# EAGLE schematic toyotune_3s_coolrunner (EAGLE 7.7.0)

## Sheet 1 of 5
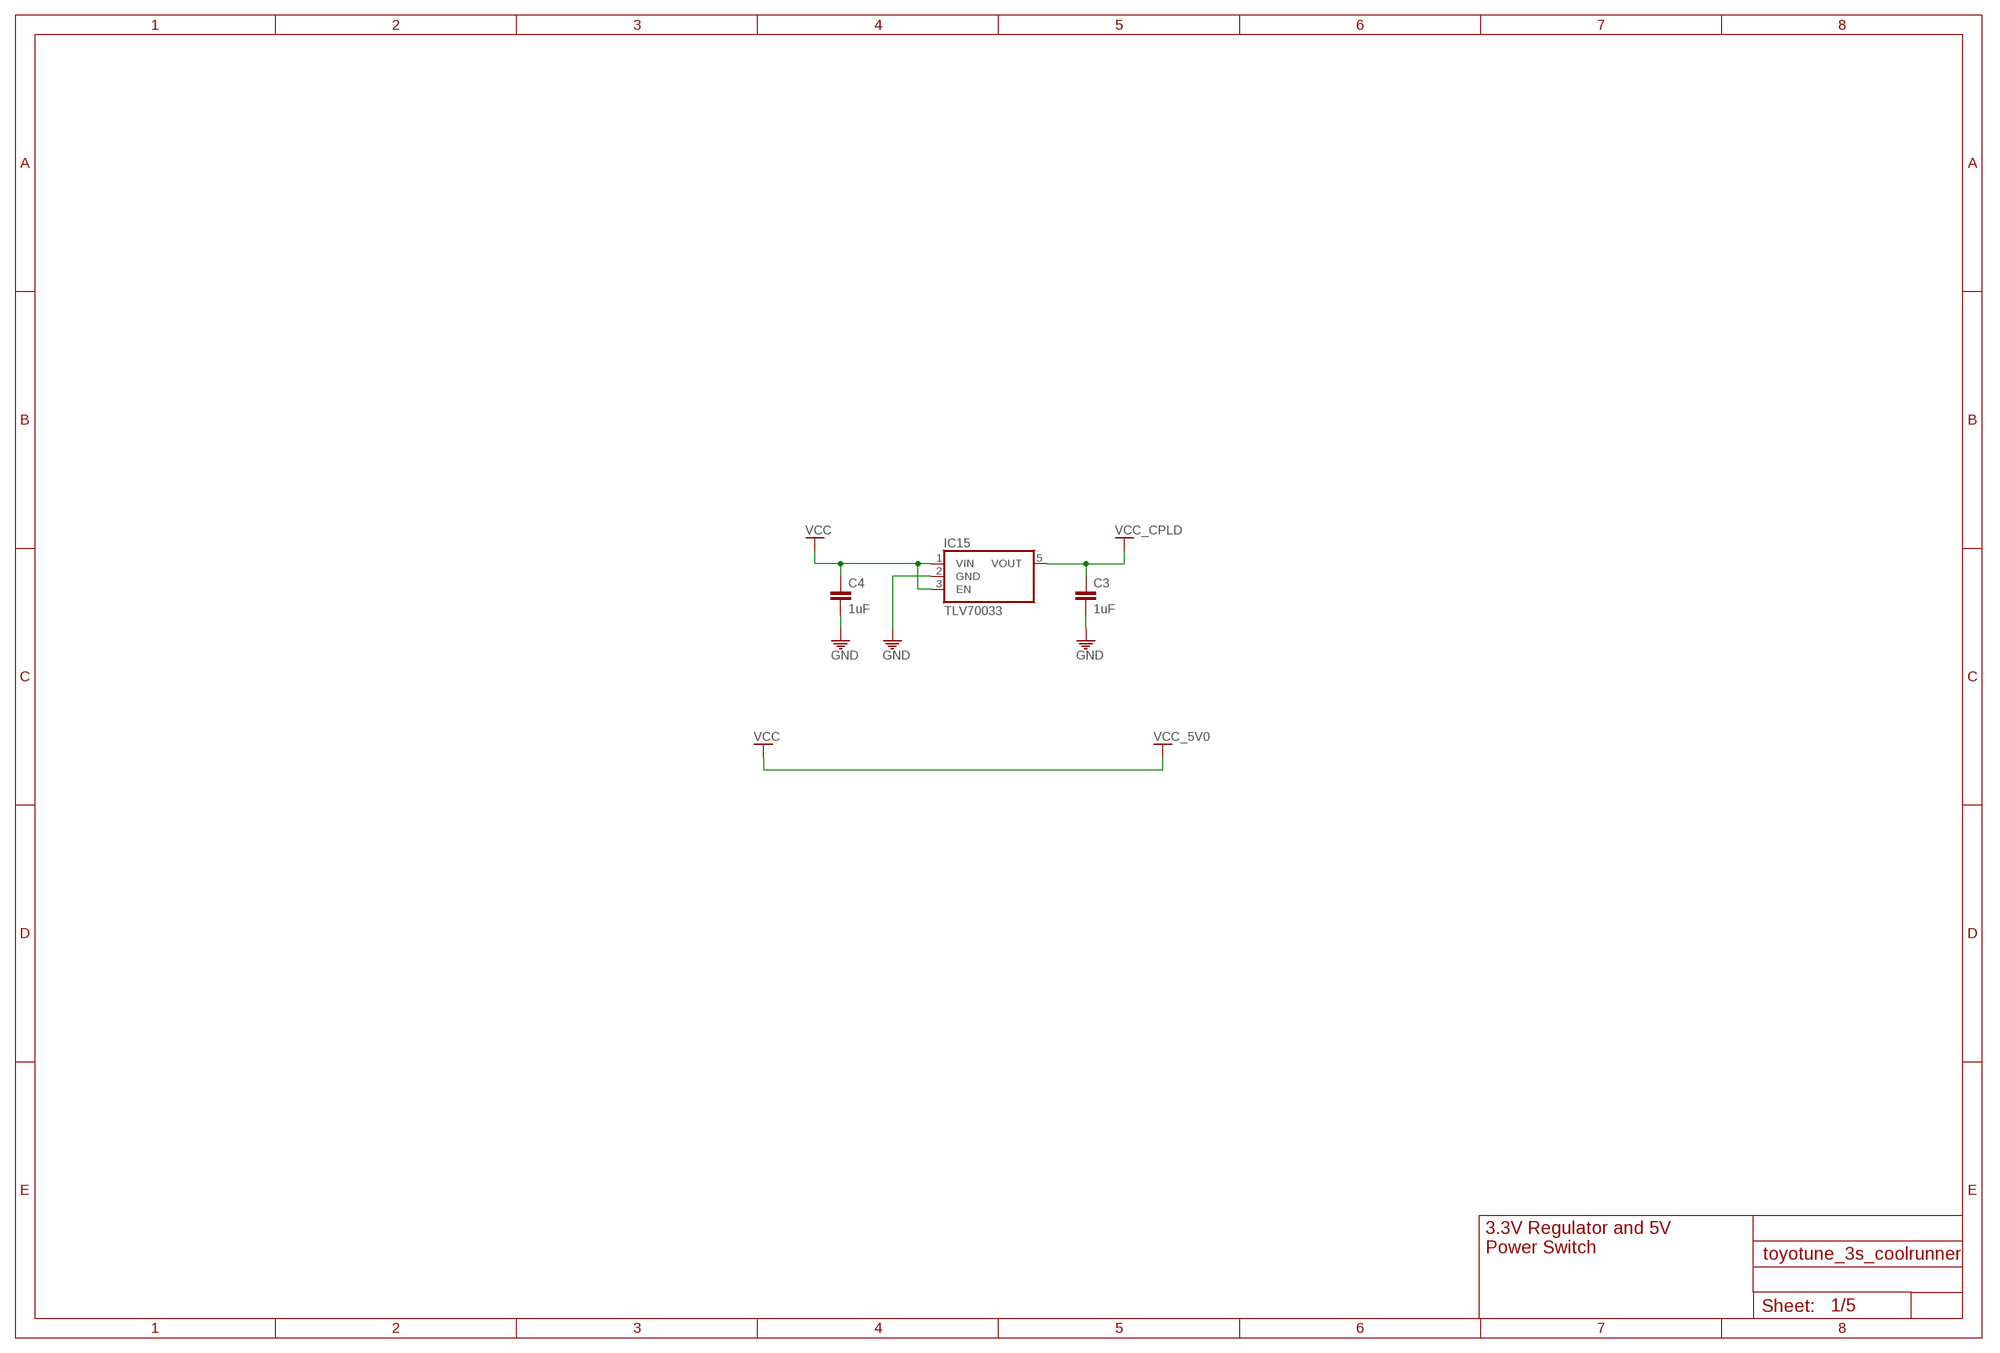
[diagram p0: schematic, sheet 1]

### Parts
C3  1uF  C-EUC0603  [C0603]
C4  1uF  C-EUC0603  [C0603]
IC15  TLV70033  [DDC_R-PDSO-G5]

### Nets
GND: C3.2 C4.2 IC15.2(GND) ; also sheet 2,3,4,5
VCC: C4.1 IC15.1(VIN) IC15.3(EN) ; supply symbol labelled VCC_5V0 ; also sheet 2,3,4,5
VCC_CPLD: C3.1 IC15.5(VOUT) ; also sheet 4,5

### Notes on the sheet
- 3.3V Regulator and 5V
- Power Switch

## Sheet 2 of 5
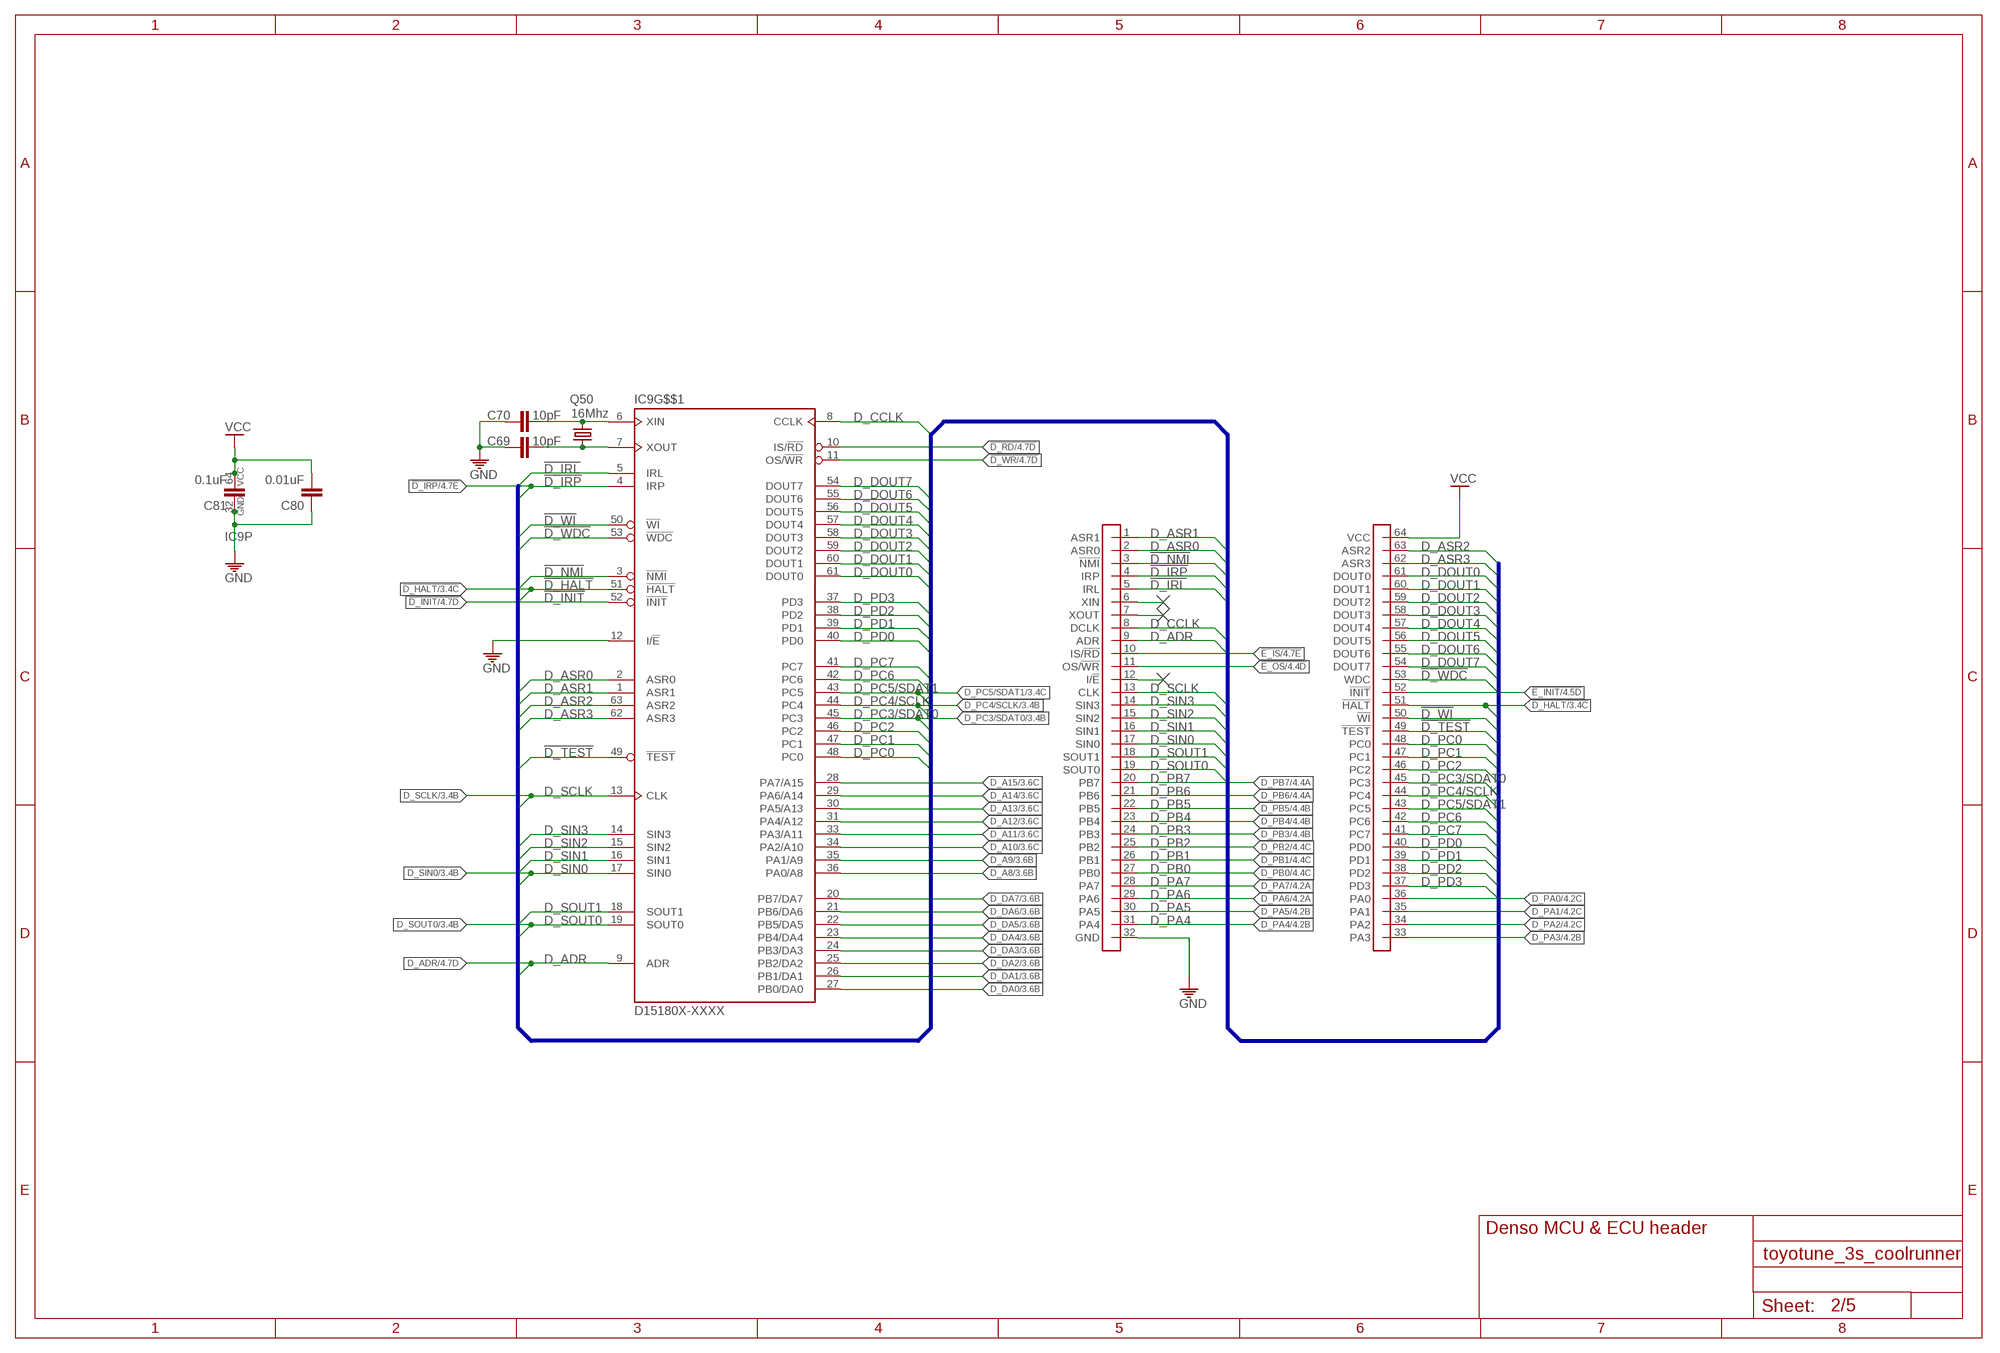
[diagram p1: schematic, sheet 2]

### Parts
C69  10pF  C-EUC0603  [C0603]
C70  10pF  C-EUC0603  [C0603]
C80  0.01uF  C-EUC0603  [C0603]
C81  0.1uF  C-EUC0603  [C0603]
IC9  D15180X-XXXX  D151803-9661  [SDIP-64]
Q50  16Mhz  CRYSTAL5X3  [CRYSTAL-SMD-5X3]
U1  D151803-CONN  [SDIP-64-CONN]

### Nets
!D_HALT: IC9.51(G$$1:!HALT) U1.51(!HALT) ; also sheet 3
!D_INIT: IC9.52(G$$1:!INIT) ; also sheet 4,5
!D_IRL: IC9.5(G$$1:IRL) U1.5(IRL)
!D_IRP: IC9.4(G$$1:IRP) U1.4(IRP) ; also sheet 4,5
!D_NMI: IC9.3(G$$1:!NMI) U1.3(!NMI)
!D_RD: IC9.10(G$$1:IS/!RD) ; also sheet 4,5
!D_TEST: IC9.49(G$$1:!TEST) U1.49(!TEST)
!D_WDC: IC9.53(G$$1:!WDC) U1.53(WDC)
!D_WI: IC9.50(G$$1:!WI) U1.50(!WI)
!D_WR: IC9.11(G$$1:OS/!WR) ; also sheet 4,5
!E_INIT: U1.52(!INIT) ; also sheet 4,5
!E_IS: U1.10(IS/!RD) ; also sheet 4,5
!E_OS: U1.11(OS/!WR) ; also sheet 4,5
D1_XIN: C70.2 IC9.6(G$$1:XIN) Q50.3 ; also sheet 3
D1_XOUT: C69.1 IC9.7(G$$1:XOUT) Q50.1
D_A8: IC9.36(G$$1:PA0/A8) ; also sheet 3,4,5
D_A9: IC9.35(G$$1:PA1/A9) ; also sheet 3,4,5
D_A10: IC9.34(G$$1:PA2/A10) ; also sheet 3,4,5
D_A11: IC9.33(G$$1:PA3/A11) ; also sheet 3,4,5
D_A12: IC9.31(G$$1:PA4/A12) ; also sheet 3,4,5
D_A13: IC9.30(G$$1:PA5/A13) ; also sheet 3,4,5
D_A14: IC9.29(G$$1:PA6/A14) ; also sheet 3,4,5
D_A15: IC9.28(G$$1:PA7/A15) ; also sheet 3,4,5
D_ADR: IC9.9(G$$1:ADR) U1.9(ADR) ; also sheet 4,5
D_ASR0: IC9.2(G$$1:ASR0) U1.2(ASR0)
D_ASR1: IC9.1(G$$1:ASR1) U1.1(ASR1)
D_ASR2: IC9.63(G$$1:ASR2) U1.63(ASR2) ; also sheet 3
D_ASR3: IC9.62(G$$1:ASR3) U1.62(ASR3)
D_CCLK: IC9.8(G$$1:CCLK) U1.8(DCLK) ; also sheet 4,5
D_DA0: IC9.27(G$$1:PB0/DA0) ; also sheet 3,4,5
D_DA1: IC9.26(G$$1:PB1/DA1) ; also sheet 3,4,5
D_DA2: IC9.25(G$$1:PB2/DA2) ; also sheet 3,4,5
D_DA3: IC9.24(G$$1:PB3/DA3) ; also sheet 3,4,5
D_DA4: IC9.23(G$$1:PB4/DA4) ; also sheet 3,4,5
D_DA5: IC9.22(G$$1:PB5/DA5) ; also sheet 3,4,5
D_DA6: IC9.21(G$$1:PB6/DA6) ; also sheet 3,4,5
D_DA7: IC9.20(G$$1:PB7/DA7) ; also sheet 3,4,5
D_DOUT0: IC9.61(G$$1:DOUT0) U1.61(DOUT0)
D_DOUT1: IC9.60(G$$1:DOUT1) U1.60(DOUT1)
D_DOUT2: IC9.59(G$$1:DOUT2) U1.59(DOUT2)
D_DOUT3: IC9.58(G$$1:DOUT3) U1.58(DOUT3)
D_DOUT4: IC9.57(G$$1:DOUT4) U1.57(DOUT4)
D_DOUT5: IC9.56(G$$1:DOUT5) U1.56(DOUT5)
D_DOUT6: IC9.55(G$$1:DOUT6) U1.55(DOUT6)
D_DOUT7: IC9.54(G$$1:DOUT7) U1.54(DOUT7)
D_PA0: U1.36(PA0) ; also sheet 4
D_PA1: U1.35(PA1) ; also sheet 4
D_PA2: U1.34(PA2) ; also sheet 4
D_PA3: U1.33(PA3) ; also sheet 4
D_PA4: U1.31(PA4) ; also sheet 4
D_PA5: U1.30(PA5) ; also sheet 4
D_PA6: U1.29(PA6) ; also sheet 4
D_PA7: U1.28(PA7) ; also sheet 4
D_PB0: U1.27(PB0) ; also sheet 4
D_PB1: U1.26(PB1) ; also sheet 4
D_PB2: U1.25(PB2) ; also sheet 4
D_PB3: U1.24(PB3) ; also sheet 4
D_PB4: U1.23(PB4) ; also sheet 4
D_PB5: U1.22(PB5) ; also sheet 4
D_PB6: U1.21(PB6) ; also sheet 4
D_PB7: U1.20(PB7) ; also sheet 4
D_PC0: IC9.48(G$$1:PC0) U1.48(PC0)
D_PC1: IC9.47(G$$1:PC1) U1.47(PC1)
D_PC2: IC9.46(G$$1:PC2) U1.46(PC2)
D_PC3/SDAT0: IC9.45(G$$1:PC3) U1.45(PC3) ; also sheet 3
D_PC4/SCLK: IC9.44(G$$1:PC4) U1.44(PC4) ; also sheet 3
D_PC5/SDAT1: IC9.43(G$$1:PC5) U1.43(PC5) ; also sheet 3
D_PC6: IC9.42(G$$1:PC6) U1.42(PC6)
D_PC7: IC9.41(G$$1:PC7) U1.41(PC7)
D_PD0: IC9.40(G$$1:PD0) U1.40(PD0)
D_PD1: IC9.39(G$$1:PD1) U1.39(PD1)
D_PD2: IC9.38(G$$1:PD2) U1.38(PD2)
D_PD3: IC9.37(G$$1:PD3) U1.37(PD3)
D_SCLK: IC9.13(G$$1:CLK) U1.13(CLK) ; also sheet 3
D_SIN0: IC9.17(G$$1:SIN0) U1.17(SIN0) ; also sheet 3
D_SIN1: IC9.16(G$$1:SIN1) U1.16(SIN1)
D_SIN2: IC9.15(G$$1:SIN2) U1.15(SIN2)
D_SIN3: IC9.14(G$$1:SIN3) U1.14(SIN3)
D_SOUT0: IC9.19(G$$1:SOUT0) U1.19(SOUT0) ; also sheet 3
D_SOUT1: IC9.18(G$$1:SOUT1) U1.18(SOUT1)
GND: C69.2 C70.1 C80.1 C81.1 IC9.12(G$$1:I/!E) IC9.32(P:GND) U1.32(GND) ; also sheet 1,3,4,5
N$28: U1.6(XIN)
N$29: U1.7(XOUT)
N$30: U1.12(I/!E)
VCC: C80.2 C81.2 IC9.64(P:VCC) U1.64(VCC) ; also sheet 1,3,4,5

### Buses
!D_IRL,!D_IRP,!D_WI,!D_WDC,!D_NMI,!D_HALT,!D1_INIT,D_ASR[0..3],!D_TEST,D_PC[0..2],D_PC5/SDAT1,D_PC4/SCLK,D_PC3/SDAT0,D_PC6,D_PC7,D_PD[0..3],D_ADR,D_SIN[0..3],D_SOUT[0..1],D_SCLK,D_CCLK,D_DOUT[0..7]

### Notes on the sheet
- Denso MCU & ECU header

## Sheet 3 of 5
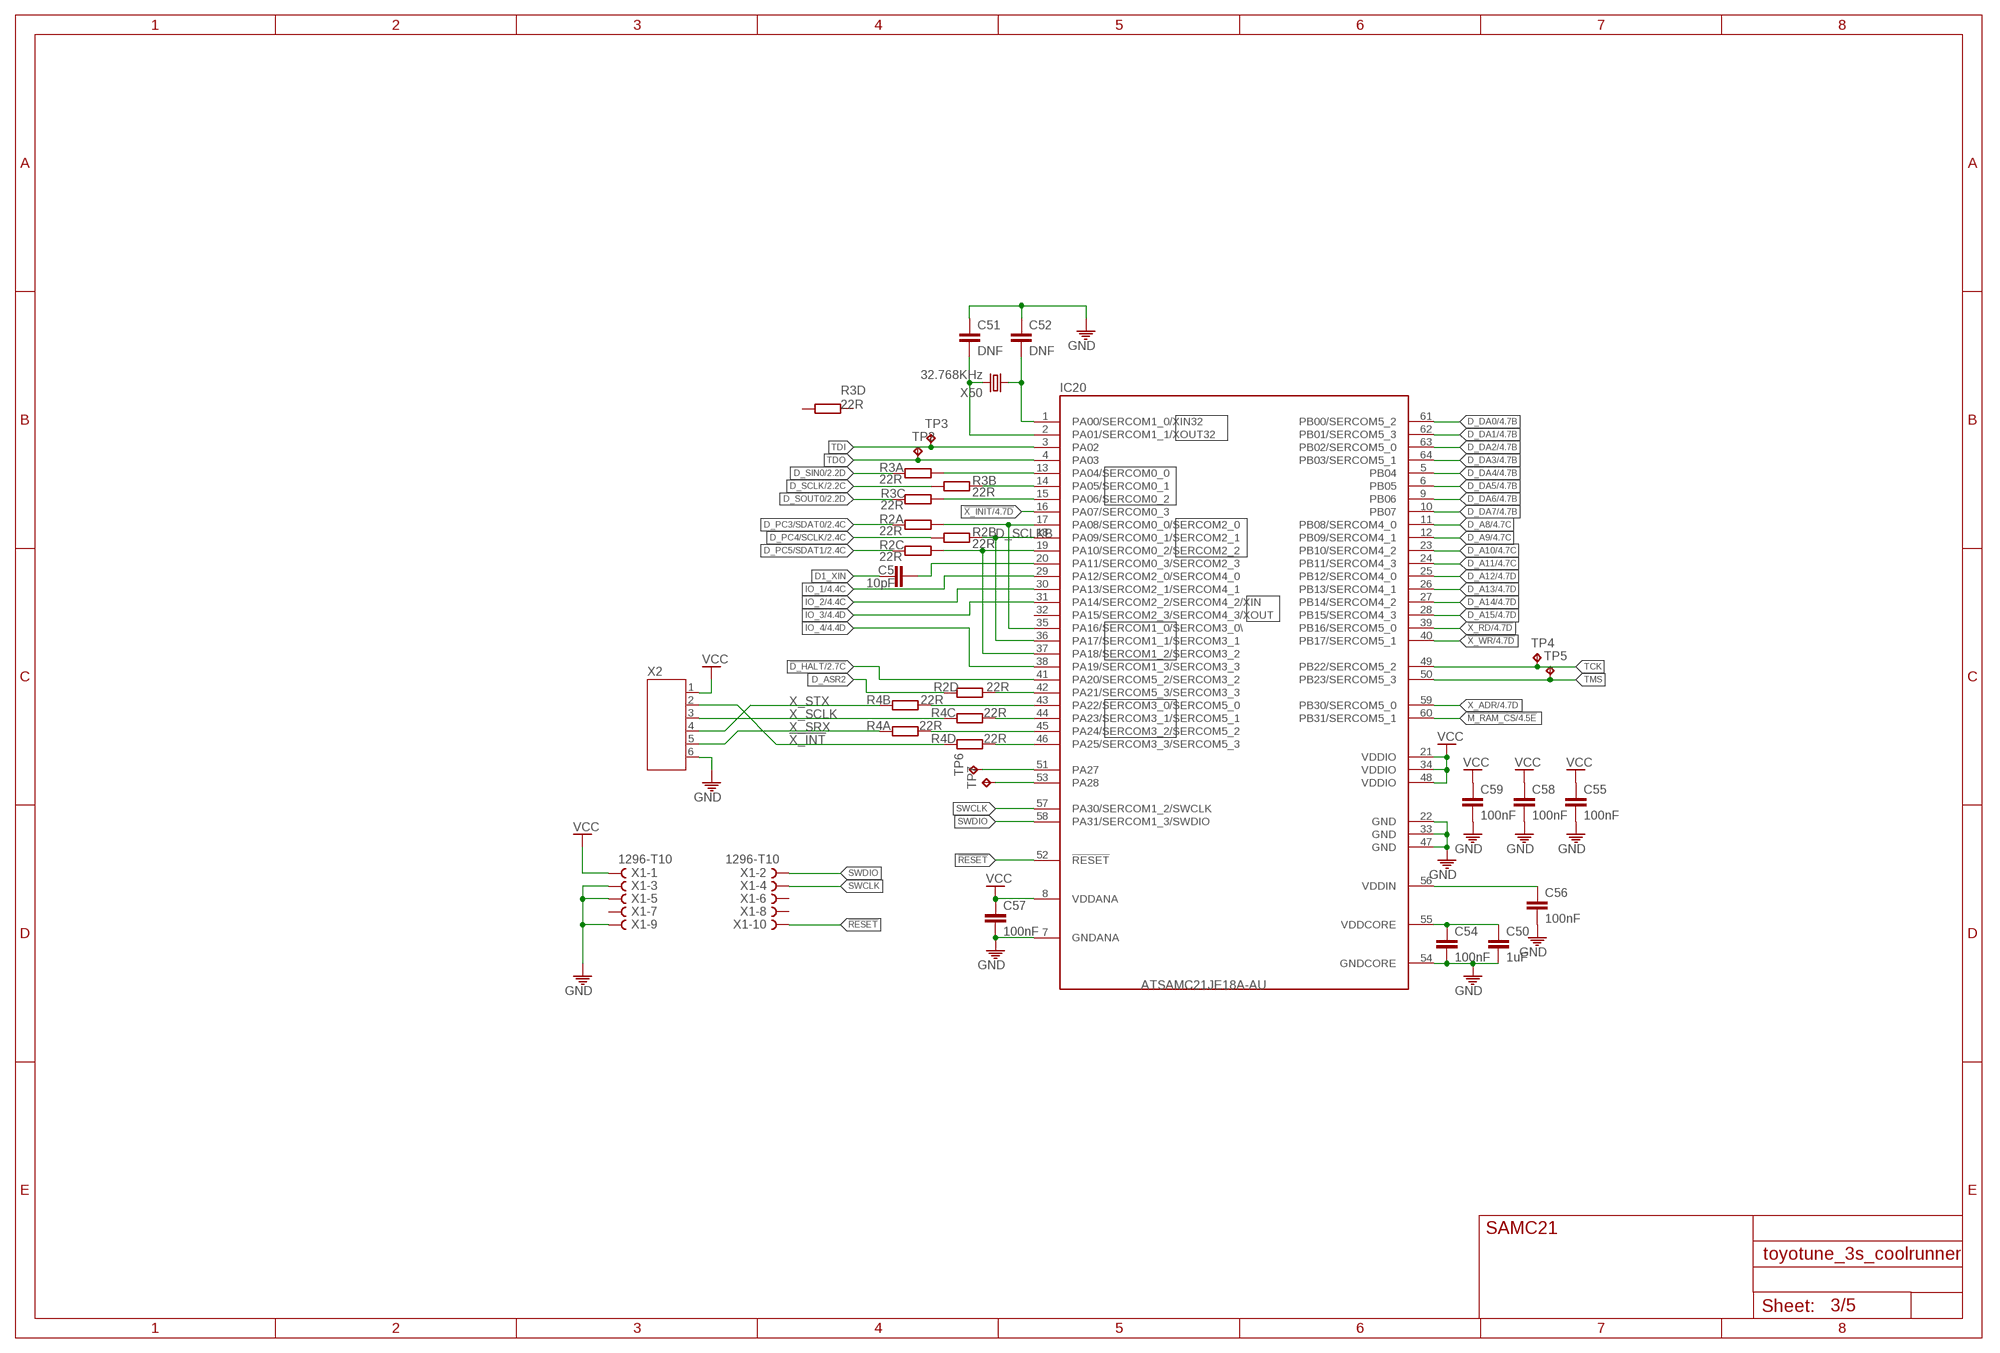
[diagram p2: schematic, sheet 3]

### Parts
C5  10pF  C-EUC0603  [C0603]
C50  1uF  C-EUC0603  [C0603]
C51  DNF  C-EUC0603  [C0603]
C52  DNF  C-EUC0603  [C0603]
C54  100nF  C-EUC0603  [C0603]
C55  100nF  C-EUC0603  [C0603]
C56  100nF  C-EUC0603  [C0603]
C57  100nF  C-EUC0603  [C0603]
C58  100nF  C-EUC0603  [C0603]
C59  100nF  C-EUC0603  [C0603]
IC20  ATSAMC21JE18A-AU  [TQFP64-05]
R2  22R  CAT16-J4  [CAT16-J4]
R3  22R  CAT16-J4  [CAT16-J4]
R4  22R  CAT16-J4  [CAT16-J4]
TP2  TPTP08R  [TP08R]
TP3  TPTP08R  [TP08R]
TP4  TPTP08R  [TP08R]
TP5  TPTP08R  [TP08R]
TP6  TPTP08R  [TP08R]
TP7  TPTP08R  [TP08R]
X1  1296-T10  [1296-10]
X2  JST-PH6  [JST-PH6]
X50  32.768KHz  CRYSTALS-NOGND-CFPX-217  [3.2X1.5-2-PAD]

### Nets
!A_INT: IC20.46(PA25/SERCOM3_3/SERCOM5_3) R4.4
!D_HALT: IC20.41(PA20/SERCOM5_2/SERCOM3_2) ; also sheet 2
!M_RAM_CS: IC20.60(PB31/SERCOM5_1) ; also sheet 4,5
!RESET: IC20.52(!RESET) X1.10
!X_INIT: IC20.16(PA07/SERCOM0_3) ; also sheet 4,5
!X_INT: R4.5 X2.2
!X_RD: IC20.39(PB16/SERCOM5_0) ; also sheet 4,5
!X_WR: IC20.40(PB17/SERCOM5_1) ; also sheet 4,5
D1_XIN: C5.1 ; also sheet 2
D_A8: IC20.11(PB08/SERCOM4_0) ; also sheet 2,4,5
D_A9: IC20.12(PB09/SERCOM4_1) ; also sheet 2,4,5
D_A10: IC20.23(PB10/SERCOM4_2) ; also sheet 2,4,5
D_A11: IC20.24(PB11/SERCOM4_3) ; also sheet 2,4,5
D_A12: IC20.25(PB12/SERCOM4_0) ; also sheet 2,4,5
D_A13: IC20.26(PB13/SERCOM4_1) ; also sheet 2,4,5
D_A14: IC20.27(PB14/SERCOM4_2) ; also sheet 2,4,5
D_A15: IC20.28(PB15/SERCOM4_3) ; also sheet 2,4,5
D_ASR2: R2.4 ; also sheet 2
D_DA0: IC20.61(PB00/SERCOM5_2) ; also sheet 2,4,5
D_DA1: IC20.62(PB01/SERCOM5_3) ; also sheet 2,4,5
D_DA2: IC20.63(PB02/SERCOM5_0) ; also sheet 2,4,5
D_DA3: IC20.64(PB03/SERCOM5_1) ; also sheet 2,4,5
D_DA4: IC20.5(PB04) ; also sheet 2,4,5
D_DA5: IC20.6(PB05) ; also sheet 2,4,5
D_DA6: IC20.9(PB06) ; also sheet 2,4,5
D_DA7: IC20.10(PB07) ; also sheet 2,4,5
D_PC3/SDAT0: R2.1 ; also sheet 2
D_PC4/SCLK: R2.2 ; also sheet 2
D_PC5/SDAT1: R2.3 ; also sheet 2
D_SCLK: R3.2 ; also sheet 2
D_SCLKA: IC20.14(PA05/SERCOM0_1) R3.7
D_SCLKB: IC20.18(PA09/SERCOM0_1/SERCOM2_1) IC20.36(PA17/SERCOM1_1/SERCOM3_1) R2.7
D_SCLKB1: IC20.17(PA08/SERCOM0_0/SERCOM2_0) IC20.35(PA16/SERCOM1_0/SERCOM3_0\) R2.8
D_SDATA0: IC20.15(PA06/SERCOM0_2) R3.6
D_SDATA1: IC20.13(PA04/SERCOM0_0) R3.8
D_SDATB1: IC20.19(PA10/SERCOM0_2/SERCOM2_2) IC20.37(PA18/SERCOM1_2/SERCOM3_2) R2.6
D_SIN0: R3.1 ; also sheet 2
D_SOUT0: R3.3 ; also sheet 2
GND: C50.2 C51.1 C52.1 C54.2 C55.2 C56.2 C57.2 C58.2 C59.2 IC20.7(GNDANA) IC20.22(GND) IC20.33(GND) IC20.47(GND) IC20.54(GNDCORE) X1.3 X1.5 X1.9 X2.6 ; also sheet 1,2,4,5
IO_1: IC20.29(PA12/SERCOM2_0/SERCOM4_0) ; also sheet 4,5
IO_2: IC20.30(PA13/SERCOM2_1/SERCOM4_1) ; also sheet 4,5
IO_3: IC20.31(PA14/SERCOM2_2/SERCOM4_2/XIN) ; also sheet 4,5
IO_4: IC20.38(PA19/SERCOM1_3/SERCOM3_3) ; also sheet 4,5
N$1: C56.1 IC20.56(VDDIN)
N$2: C50.1 C54.1 IC20.55(VDDCORE)
N$4: IC20.42(PA21/SERCOM5_3/SERCOM3_3) R2.5
N$14: C5.2 IC20.20(PA11/SERCOM0_3/SERCOM2_3)
N$17: IC20.51(PA27) TP6.TP
N$18: IC20.53(PA28) TP7.TP
SERCOM2_0_TX: IC20.43(PA22/SERCOM3_0/SERCOM5_0) R4.2
SERCOM2_1_CLK: IC20.44(PA23/SERCOM3_1/SERCOM5_1) R4.3
SERCOM2_2_RX: IC20.45(PA24/SERCOM3_2/SERCOM5_2) R4.1
SWCLK: IC20.57(PA30/SERCOM1_2/SWCLK) X1.4
SWDIO: IC20.58(PA31/SERCOM1_3/SWDIO) X1.2
TCK: IC20.49(PB22/SERCOM5_2) TP4.TP ; also sheet 5
TDI: IC20.3(PA02) TP3.TP ; also sheet 5
TDO: IC20.4(PA03) TP2.TP ; also sheet 5
TMS: IC20.50(PB23/SERCOM5_3) TP5.TP ; also sheet 5
VCC: C55.1 C57.1 C58.1 C59.1 IC20.8(VDDANA) IC20.21(VDDIO) IC20.34(VDDIO) IC20.48(VDDIO) X1.1 X2.1 ; also sheet 1,2,4,5
X_ADR: IC20.59(PB30/SERCOM5_0) ; also sheet 4,5
X_SCLK: R4.6 X2.3
X_SRX: R4.8 X2.5
X_STX: R4.7 X2.4
XIN32: C52.2 IC20.1(PA00/SERCOM1_0/XIN32) X50.1
XOUT32: C51.2 IC20.2(PA01/SERCOM1_1/XOUT32) X50.2
Unconnected: IC20.32(PA15/SERCOM2_3/SERCOM4_3/XOUT) R3.4 R3.5 X1.6 X1.7 X1.8

### Notes on the sheet
- SAMC21

## Sheet 4 of 5
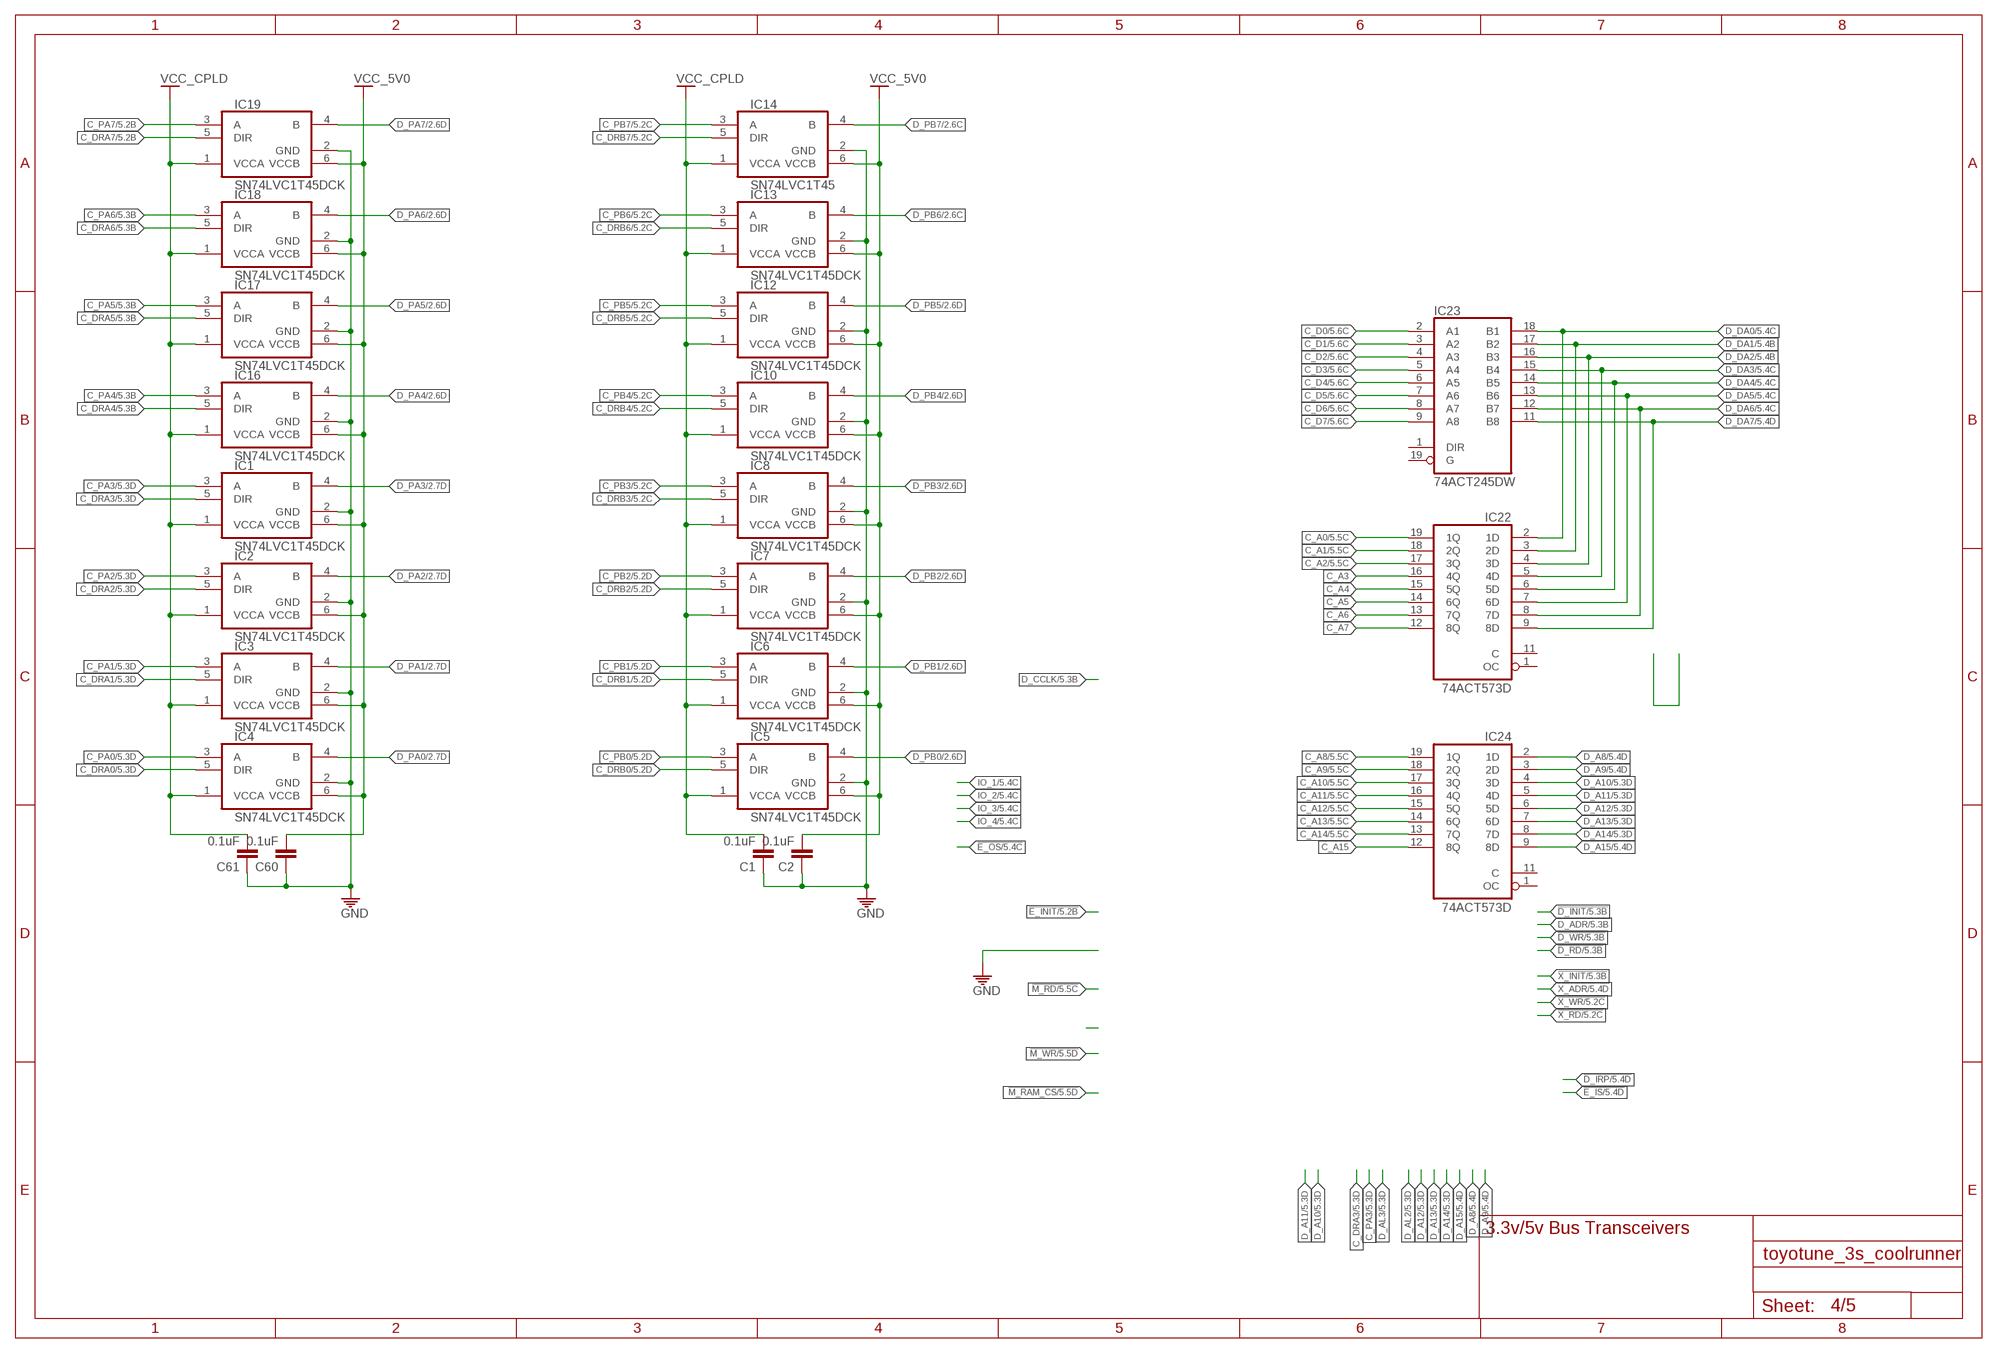
[diagram p3: schematic, sheet 4]

### Parts
C1  0.1uF  C-EUC0603  [C0603]
C2  0.1uF  C-EUC0603  [C0603]
C60  0.1uF  C-EUC0603  [C0603]
C61  0.1uF  C-EUC0603  [C0603]
IC1  SN74LVC1T45DCK  [DCK_R-PDSO-G6]
IC2  SN74LVC1T45DCK  [DCK_R-PDSO-G6]
IC3  SN74LVC1T45DCK  [DCK_R-PDSO-G6]
IC4  SN74LVC1T45DCK  [DCK_R-PDSO-G6]
IC5  SN74LVC1T45DCK  [DCK_R-PDSO-G6]
IC6  SN74LVC1T45DCK  [DCK_R-PDSO-G6]
IC7  SN74LVC1T45DCK  [DCK_R-PDSO-G6]
IC8  SN74LVC1T45DCK  [DCK_R-PDSO-G6]
IC10  SN74LVC1T45DCK  [DCK_R-PDSO-G6]
IC12  SN74LVC1T45DCK  [DCK_R-PDSO-G6]
IC13  SN74LVC1T45DCK  [DCK_R-PDSO-G6]
IC14  SN74LVC1T45  SN74LVC1T45DCK  [DCK_R-PDSO-G6]
IC16  SN74LVC1T45DCK  [DCK_R-PDSO-G6]
IC17  SN74LVC1T45DCK  [DCK_R-PDSO-G6]
IC18  SN74LVC1T45DCK  [DCK_R-PDSO-G6]
IC19  SN74LVC1T45DCK  [DCK_R-PDSO-G6]
IC22  74ACT573D  [SO20W]
IC23  74ACT245DW  [SO20W]
IC24  74ACT573D  [SO20W]

### Nets
C_A0: IC22.19(1Q) ; also sheet 5
C_A1: IC22.18(2Q) ; also sheet 5
C_A2: IC22.17(3Q) ; also sheet 5
C_A3: IC22.16(4Q)
C_A4: IC22.15(5Q)
C_A5: IC22.14(6Q)
C_A6: IC22.13(7Q)
C_A7: IC22.12(8Q)
C_A8: IC24.19(1Q) ; also sheet 5
C_A9: IC24.18(2Q) ; also sheet 5
C_A10: IC24.17(3Q) ; also sheet 5
C_A11: IC24.16(4Q) ; also sheet 5
C_A12: IC24.15(5Q) ; also sheet 5
C_A13: IC24.14(6Q) ; also sheet 5
C_A14: IC24.13(7Q) ; also sheet 5
C_A15: IC24.12(8Q)
C_D0: IC23.2(A1) ; also sheet 5
C_D1: IC23.3(A2) ; also sheet 5
C_D2: IC23.4(A3) ; also sheet 5
C_D3: IC23.5(A4) ; also sheet 5
C_D4: IC23.6(A5) ; also sheet 5
C_D5: IC23.7(A6) ; also sheet 5
C_D6: IC23.8(A7) ; also sheet 5
C_D7: IC23.9(A8) ; also sheet 5
C_DRA0: IC4.5(DIR) ; also sheet 5
C_DRA1: IC3.5(DIR) ; also sheet 5
C_DRA2: IC2.5(DIR) ; also sheet 5
C_DRA3: IC1.5(DIR) ; also sheet 5
C_DRA4: IC16.5(DIR) ; also sheet 5
C_DRA5: IC17.5(DIR) ; also sheet 5
C_DRA6: IC18.5(DIR) ; also sheet 5
C_DRA7: IC19.5(DIR) ; also sheet 5
C_DRB0: IC5.5(DIR) ; also sheet 5
C_DRB1: IC6.5(DIR) ; also sheet 5
C_DRB2: IC7.5(DIR) ; also sheet 5
C_DRB3: IC8.5(DIR) ; also sheet 5
C_DRB4: IC10.5(DIR) ; also sheet 5
C_DRB5: IC12.5(DIR) ; also sheet 5
C_DRB6: IC13.5(DIR) ; also sheet 5
C_DRB7: IC14.5(DIR) ; also sheet 5
C_PA0: IC4.3(A) ; also sheet 5
C_PA1: IC3.3(A) ; also sheet 5
C_PA2: IC2.3(A) ; also sheet 5
C_PA3: IC1.3(A) ; also sheet 5
C_PA4: IC16.3(A) ; also sheet 5
C_PA5: IC17.3(A) ; also sheet 5
C_PA6: IC18.3(A) ; also sheet 5
C_PA7: IC19.3(A) ; also sheet 5
C_PB0: IC5.3(A) ; also sheet 5
C_PB1: IC6.3(A) ; also sheet 5
C_PB2: IC7.3(A) ; also sheet 5
C_PB3: IC8.3(A) ; also sheet 5
C_PB4: IC10.3(A) ; also sheet 5
C_PB5: IC12.3(A) ; also sheet 5
C_PB6: IC13.3(A) ; also sheet 5
C_PB7: IC14.3(A) ; also sheet 5
D_A8: IC24.2(1D) ; also sheet 2,3,5
D_A9: IC24.3(2D) ; also sheet 2,3,5
D_A10: IC24.4(3D) ; also sheet 2,3,5
D_A11: IC24.5(4D) ; also sheet 2,3,5
D_A12: IC24.6(5D) ; also sheet 2,3,5
D_A13: IC24.7(6D) ; also sheet 2,3,5
D_A14: IC24.8(7D) ; also sheet 2,3,5
D_A15: IC24.9(8D) ; also sheet 2,3,5
D_DA0: IC22.2(1D) IC23.18(B1) ; also sheet 2,3,5
D_DA1: IC22.3(2D) IC23.17(B2) ; also sheet 2,3,5
D_DA2: IC22.4(3D) IC23.16(B3) ; also sheet 2,3,5
D_DA3: IC22.5(4D) IC23.15(B4) ; also sheet 2,3,5
D_DA4: IC22.6(5D) IC23.14(B5) ; also sheet 2,3,5
D_DA5: IC22.7(6D) IC23.13(B6) ; also sheet 2,3,5
D_DA6: IC22.8(7D) IC23.12(B7) ; also sheet 2,3,5
D_DA7: IC22.9(8D) IC23.11(B8) ; also sheet 2,3,5
D_PA0: IC4.4(B) ; also sheet 2
D_PA1: IC3.4(B) ; also sheet 2
D_PA2: IC2.4(B) ; also sheet 2
D_PA3: IC1.4(B) ; also sheet 2
D_PA4: IC16.4(B) ; also sheet 2
D_PA5: IC17.4(B) ; also sheet 2
D_PA6: IC18.4(B) ; also sheet 2
D_PA7: IC19.4(B) ; also sheet 2
D_PB0: IC5.4(B) ; also sheet 2
D_PB1: IC6.4(B) ; also sheet 2
D_PB2: IC7.4(B) ; also sheet 2
D_PB3: IC8.4(B) ; also sheet 2
D_PB4: IC10.4(B) ; also sheet 2
D_PB5: IC12.4(B) ; also sheet 2
D_PB6: IC13.4(B) ; also sheet 2
D_PB7: IC14.4(B) ; also sheet 2
GND: C1.1 C2.1 C60.1 C61.1 IC1.2(GND) IC2.2(GND) IC3.2(GND) IC4.2(GND) IC5.2(GND) IC6.2(GND) IC7.2(GND) IC8.2(GND) IC10.2(GND) IC12.2(GND) IC13.2(GND) IC14.2(GND) IC16.2(GND) IC17.2(GND) IC18.2(GND) IC19.2(GND) ; also sheet 1,2,3,5
VCC: C2.2 C60.2 IC1.6(VCCB) IC2.6(VCCB) IC3.6(VCCB) IC4.6(VCCB) IC5.6(VCCB) IC6.6(VCCB) IC7.6(VCCB) IC8.6(VCCB) IC10.6(VCCB) IC12.6(VCCB) IC13.6(VCCB) IC14.6(VCCB) IC16.6(VCCB) IC17.6(VCCB) IC18.6(VCCB) IC19.6(VCCB) ; supply symbol labelled VCC_5V0 ; also sheet 1,2,3,5
VCC_CPLD: C1.2 C61.2 IC1.1(VCCA) IC2.1(VCCA) IC3.1(VCCA) IC4.1(VCCA) IC5.1(VCCA) IC6.1(VCCA) IC7.1(VCCA) IC8.1(VCCA) IC10.1(VCCA) IC12.1(VCCA) IC13.1(VCCA) IC14.1(VCCA) IC16.1(VCCA) IC17.1(VCCA) IC18.1(VCCA) IC19.1(VCCA) ; also sheet 1,5
Unconnected: IC22.1(OC) IC22.11(C) IC23.1(DIR) IC23.19(G) IC24.1(OC) IC24.11(C)

### Notes on the sheet
- 3.3v/5v Bus Transceivers

## Sheet 5 of 5
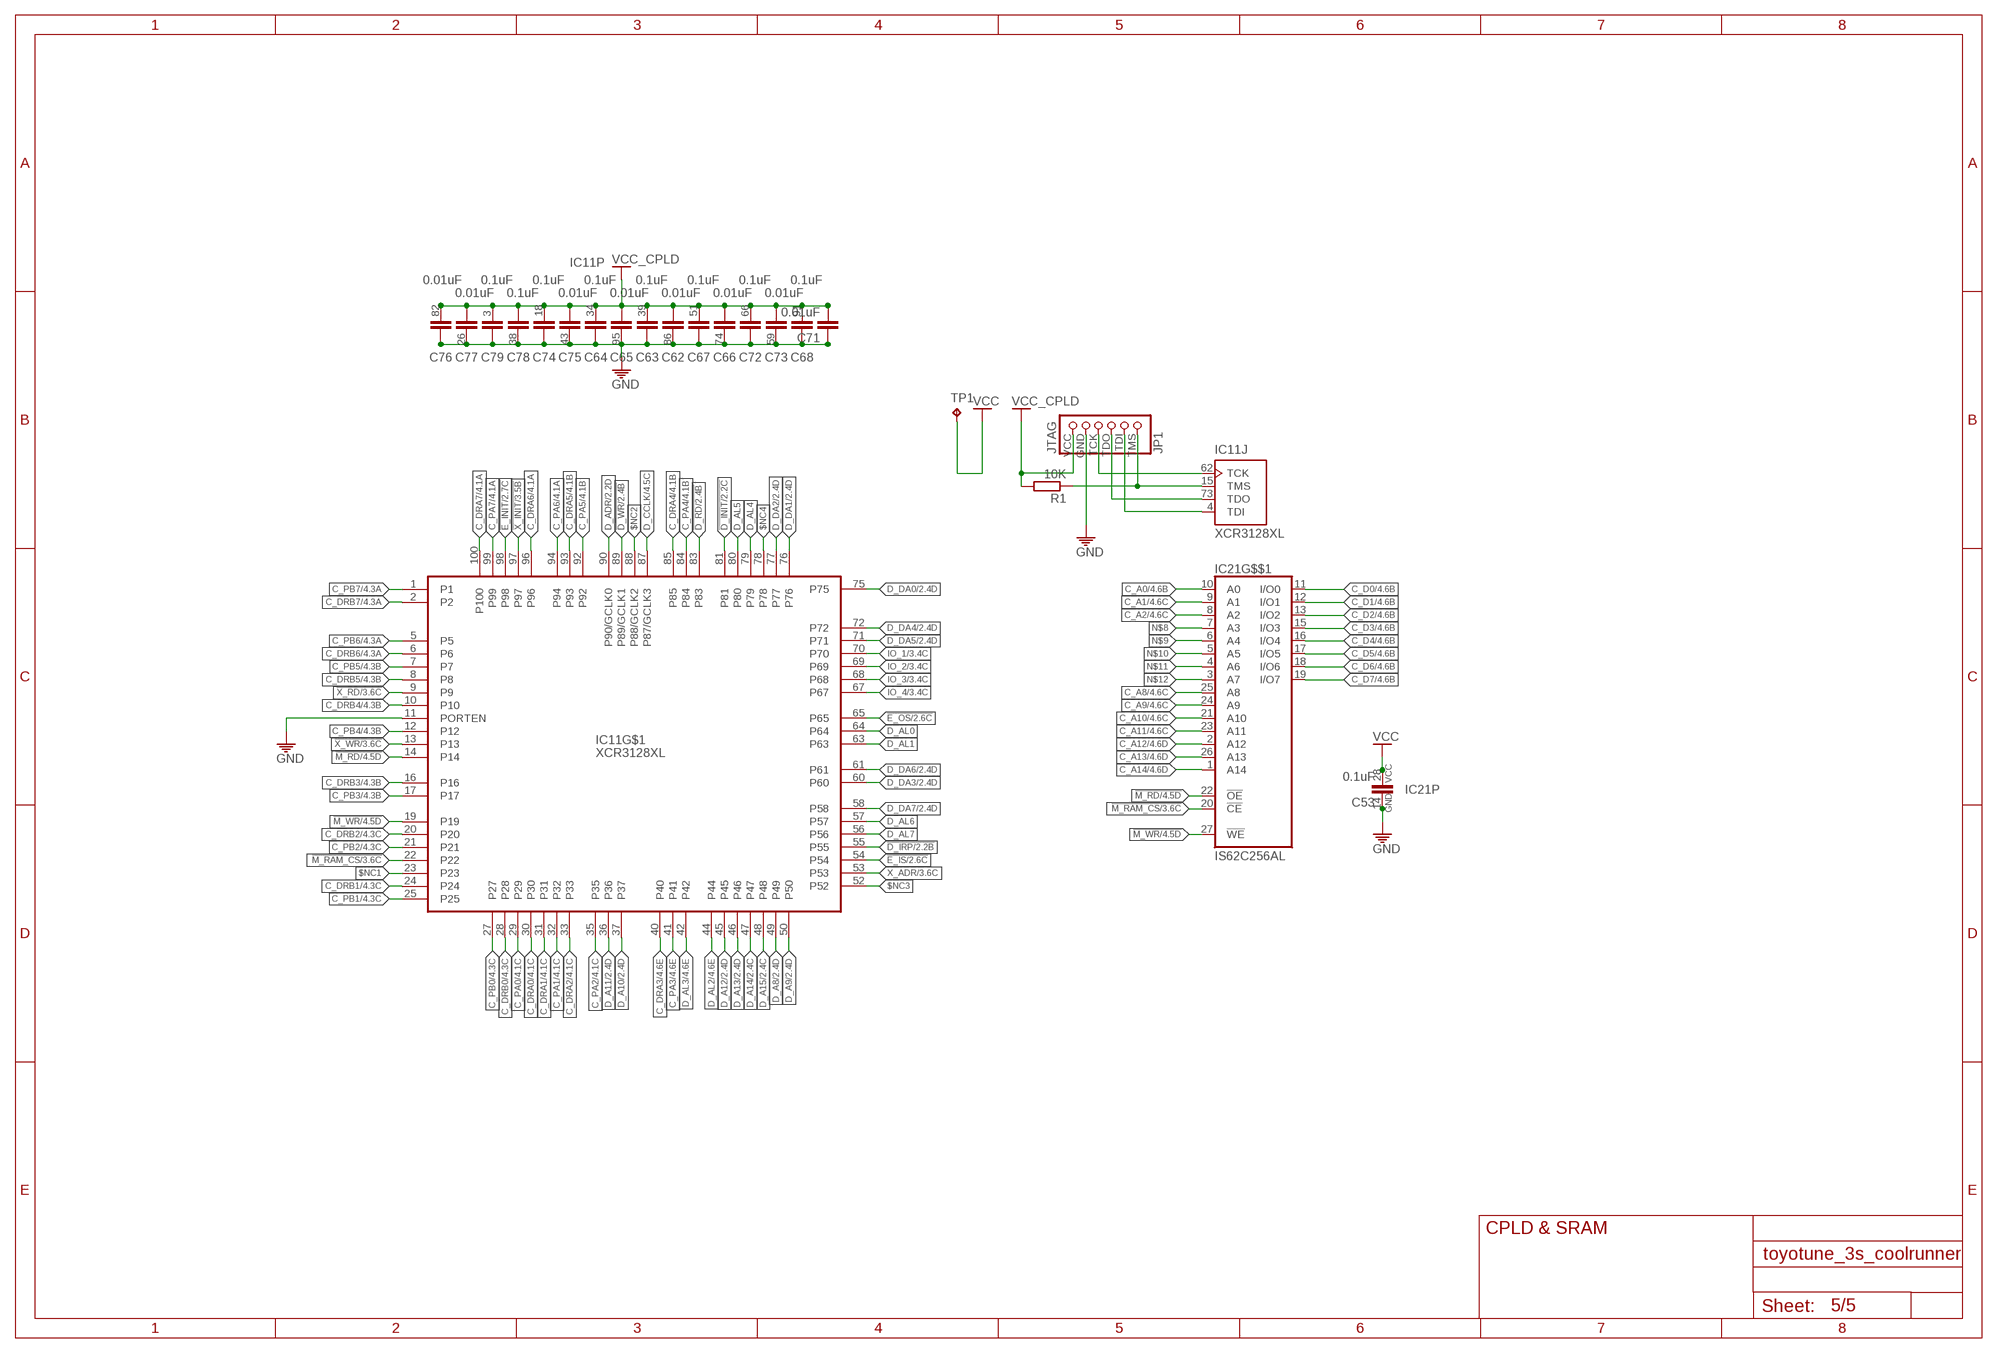
[diagram p4: schematic, sheet 5]

### Parts
C53  0.1uF  C-EUC0603  [C0603]
C62  0.01uF  C-EUC0603  [C0603]
C63  0.1uF  C-EUC0603  [C0603]
C64  0.1uF  C-EUC0603  [C0603]
C65  0.01uF  C-EUC0603  [C0603]
C66  0.01uF  C-EUC0603  [C0603]
C67  0.1uF  C-EUC0603  [C0603]
C68  0.1uF  C-EUC0603  [C0603]
C71  0.01uF  C-EUC0603  [C0603]
C72  0.1uF  C-EUC0603  [C0603]
C73  0.01uF  C-EUC0603  [C0603]
C74  0.1uF  C-EUC0603  [C0603]
C75  0.01uF  C-EUC0603  [C0603]
C76  0.01uF  C-EUC0603  [C0603]
C77  0.01uF  C-EUC0603  [C0603]
C78  0.1uF  C-EUC0603  [C0603]
C79  0.1uF  C-EUC0603  [C0603]
IC11  XCR3128XL  [VQ100]
IC21  IS62C256AL  [TSOP28]
JP1  JTAG  JTAG_HEADERS  [1X06_SMD]
R1  10K  R-EU_R0603  [R0603]
TP1  TPTP13R  [TP13R]

### Nets
!D_INIT: IC11.81 ; also sheet 2,4
!D_IRP: IC11.55 ; also sheet 2,4
!D_RD: IC11.83 ; also sheet 2,4
!D_WR: IC11.89(P89/GCLK1) ; also sheet 2,4
!E_INIT: IC11.98 ; also sheet 2,4
!E_IS: IC11.54 ; also sheet 2,4
!E_OS: IC11.65 ; also sheet 2,4
!M_RAM_CS: IC11.22 IC21.20(G$$1:!CE) ; also sheet 3,4
!M_RD: IC11.14 IC21.22(G$$1:!OE) ; also sheet 4
!M_WR: IC11.19 IC21.27(G$$1:!WE) ; also sheet 4
!X_INIT: IC11.97 ; also sheet 3,4
!X_RD: IC11.9 ; also sheet 3,4
!X_WR: IC11.13 ; also sheet 3,4
$NC1: IC11.23
$NC2: IC11.88(P88/GCLK2)
$NC3: IC11.52
$NC4: IC11.78
C_A0: IC21.10(G$$1:A0) ; also sheet 4
C_A1: IC21.9(G$$1:A1) ; also sheet 4
C_A2: IC21.8(G$$1:A2) ; also sheet 4
C_A8: IC21.25(G$$1:A8) ; also sheet 4
C_A9: IC21.24(G$$1:A9) ; also sheet 4
C_A10: IC21.21(G$$1:A10) ; also sheet 4
C_A11: IC21.23(G$$1:A11) ; also sheet 4
C_A12: IC21.2(G$$1:A12) ; also sheet 4
C_A13: IC21.26(G$$1:A13) ; also sheet 4
C_A14: IC21.1(G$$1:A14) ; also sheet 4
C_D0: IC21.11(G$$1:I/O0) ; also sheet 4
C_D1: IC21.12(G$$1:I/O1) ; also sheet 4
C_D2: IC21.13(G$$1:I/O2) ; also sheet 4
C_D3: IC21.15(G$$1:I/O3) ; also sheet 4
C_D4: IC21.16(G$$1:I/O4) ; also sheet 4
C_D5: IC21.17(G$$1:I/O5) ; also sheet 4
C_D6: IC21.18(G$$1:I/O6) ; also sheet 4
C_D7: IC21.19(G$$1:I/O7) ; also sheet 4
C_DRA0: IC11.30 ; also sheet 4
C_DRA1: IC11.31 ; also sheet 4
C_DRA2: IC11.33 ; also sheet 4
C_DRA3: IC11.40 ; also sheet 4
C_DRA4: IC11.85 ; also sheet 4
C_DRA5: IC11.93 ; also sheet 4
C_DRA6: IC11.96 ; also sheet 4
C_DRA7: IC11.100 ; also sheet 4
C_DRB0: IC11.28 ; also sheet 4
C_DRB1: IC11.24 ; also sheet 4
C_DRB2: IC11.20 ; also sheet 4
C_DRB3: IC11.16 ; also sheet 4
C_DRB4: IC11.10 ; also sheet 4
C_DRB5: IC11.8 ; also sheet 4
C_DRB6: IC11.6 ; also sheet 4
C_DRB7: IC11.2 ; also sheet 4
C_PA0: IC11.29 ; also sheet 4
C_PA1: IC11.32 ; also sheet 4
C_PA2: IC11.35 ; also sheet 4
C_PA3: IC11.41 ; also sheet 4
C_PA4: IC11.84 ; also sheet 4
C_PA5: IC11.92 ; also sheet 4
C_PA6: IC11.94 ; also sheet 4
C_PA7: IC11.99 ; also sheet 4
C_PB0: IC11.27 ; also sheet 4
C_PB1: IC11.25 ; also sheet 4
C_PB2: IC11.21 ; also sheet 4
C_PB3: IC11.17 ; also sheet 4
C_PB4: IC11.12 ; also sheet 4
C_PB5: IC11.7 ; also sheet 4
C_PB6: IC11.5 ; also sheet 4
C_PB7: IC11.1 ; also sheet 4
D_A8: IC11.49 ; also sheet 2,3,4
D_A9: IC11.50 ; also sheet 2,3,4
D_A10: IC11.37 ; also sheet 2,3,4
D_A11: IC11.36 ; also sheet 2,3,4
D_A12: IC11.45 ; also sheet 2,3,4
D_A13: IC11.46 ; also sheet 2,3,4
D_A14: IC11.47 ; also sheet 2,3,4
D_A15: IC11.48 ; also sheet 2,3,4
D_ADR: IC11.90(P90/GCLK0) ; also sheet 2,4
D_AL0: IC11.64
D_AL1: IC11.63
D_AL2: IC11.44 ; also sheet 4
D_AL3: IC11.42 ; also sheet 4
D_AL4: IC11.79
D_AL5: IC11.80
D_AL6: IC11.57
D_AL7: IC11.56
D_CCLK: IC11.87(P87/GCLK3) ; also sheet 2,4
D_DA0: IC11.75 ; also sheet 2,3,4
D_DA1: IC11.76 ; also sheet 2,3,4
D_DA2: IC11.77 ; also sheet 2,3,4
D_DA3: IC11.60 ; also sheet 2,3,4
D_DA4: IC11.72 ; also sheet 2,3,4
D_DA5: IC11.71 ; also sheet 2,3,4
D_DA6: IC11.61 ; also sheet 2,3,4
D_DA7: IC11.58 ; also sheet 2,3,4
GND: C53.1 C62.1 C63.1 C64.1 C65.1 C66.1 C67.1 C68.1 C71.1 C72.1 C73.1 C74.1 C75.1 C76.1 C77.1 C78.1 C79.1 IC11.11(PORTEN) IC11.26(P:GND) IC11.38(P:GND) IC11.43(P:GND) IC11.59(P:GND) IC11.74(P:GND) IC11.86(P:GND) IC11.95(P:GND) IC21.14(P:GND) JP1.GND ; also sheet 1,2,3,4
IO_1: IC11.70 ; also sheet 3,4
IO_2: IC11.69 ; also sheet 3,4
IO_3: IC11.68 ; also sheet 3,4
IO_4: IC11.67 ; also sheet 3,4
N$8: IC21.7(G$$1:A3)
N$9: IC21.6(G$$1:A4)
N$10: IC21.5(G$$1:A5)
N$11: IC21.4(G$$1:A6)
N$12: IC21.3(G$$1:A7)
TCK: IC11.62(J:TCK) JP1.TCK ; also sheet 3
TDI: IC11.4(J:TDI) JP1.TDI ; also sheet 3
TDO: IC11.73(J:TDO) JP1.TDO ; also sheet 3
TMS: IC11.15(J:TMS) JP1.TMS R1.1 ; also sheet 3
VCC: C53.2 IC21.28(P:VCC) TP1.TP ; also sheet 1,2,3,4
VCC_CPLD: C62.2 C63.2 C64.2 C65.2 C66.2 C67.2 C68.2 C71.2 C72.2 C73.2 C74.2 C75.2 C76.2 C77.2 C78.2 C79.2 IC11.3(P:VCC_3V3) IC11.18(P:VCC_3V3) IC11.34(P:VCC_3V3) IC11.39(P:VCC_3V3) IC11.51(P:VCC_3V3) IC11.66(P:VCC_3V3) IC11.82(P:VCC_3V3) IC11.91(P:VCC_3V3) JP1.VCC R1.2 ; also sheet 1,4
X_ADR: IC11.53 ; also sheet 3,4

### Notes on the sheet
- CPLD & SRAM

## Power pins joined to a net without a drawn wire
GND: IC22.10(GND) IC23.10(GND) IC24.10(GND)
VCC: IC22.20(VCC) IC23.20(VCC) IC24.20(VCC)

## Library data of the parts
C1-C5 C50-C81 = toyotune:C-EU: CAPACITOR, European symbol
IC1-IC8 IC10 IC12-IC14 IC16-IC19 = toyotune:SN74LVC1T45
IC9 = toyota-ecu:D151803-9661
IC11 = toyotune:XCR3128XL
IC15 = toyota-ecu:TLV70033
IC20 = toyotune:ATSAMC21
IC21 = toyotune:IS62C256AL
IC22 IC24 = 74xx-eu:74*573: 8-bit D latch BUS DRIVER
IC23 = 74xx-eu:74*245: Octal BUS TRANSCEIVER, 3-state
JP1 = toyotune:JTAG_HEADER: PIN HEADER
Q50 = toyota-ecu:CRYSTAL: Crystals Various standard crystals. Proven footprints. Spark Fun Electronics SKU : COM-00534
R1 = toyotune:R-EU_: RESISTOR, European symbol
R2-R4 = toyotune:CAT16-J4
TP1-TP7 = testpad:TP: Test pad
U1 = toyotune:D151803-CONN
X1 = toyotune:1296-T10: 1.27mm SINGLE ROW FEMALE SOCKET Source: http://www.leotronics.co.uk/Conexcon/Data%20Sheets/sec.%20A/1296ing.pdf; OC_FARNELL: unknown; OC_NEWARK: unknown
X2 = toyotune:JST-PH6
X50 = toyotune:CRYSTALS-NOGND: CRYSTALS CAN NOT GROUNDED